# EAGLE schematic STorM32 NT imu module v008 mini (EAGLE 6.5.0)
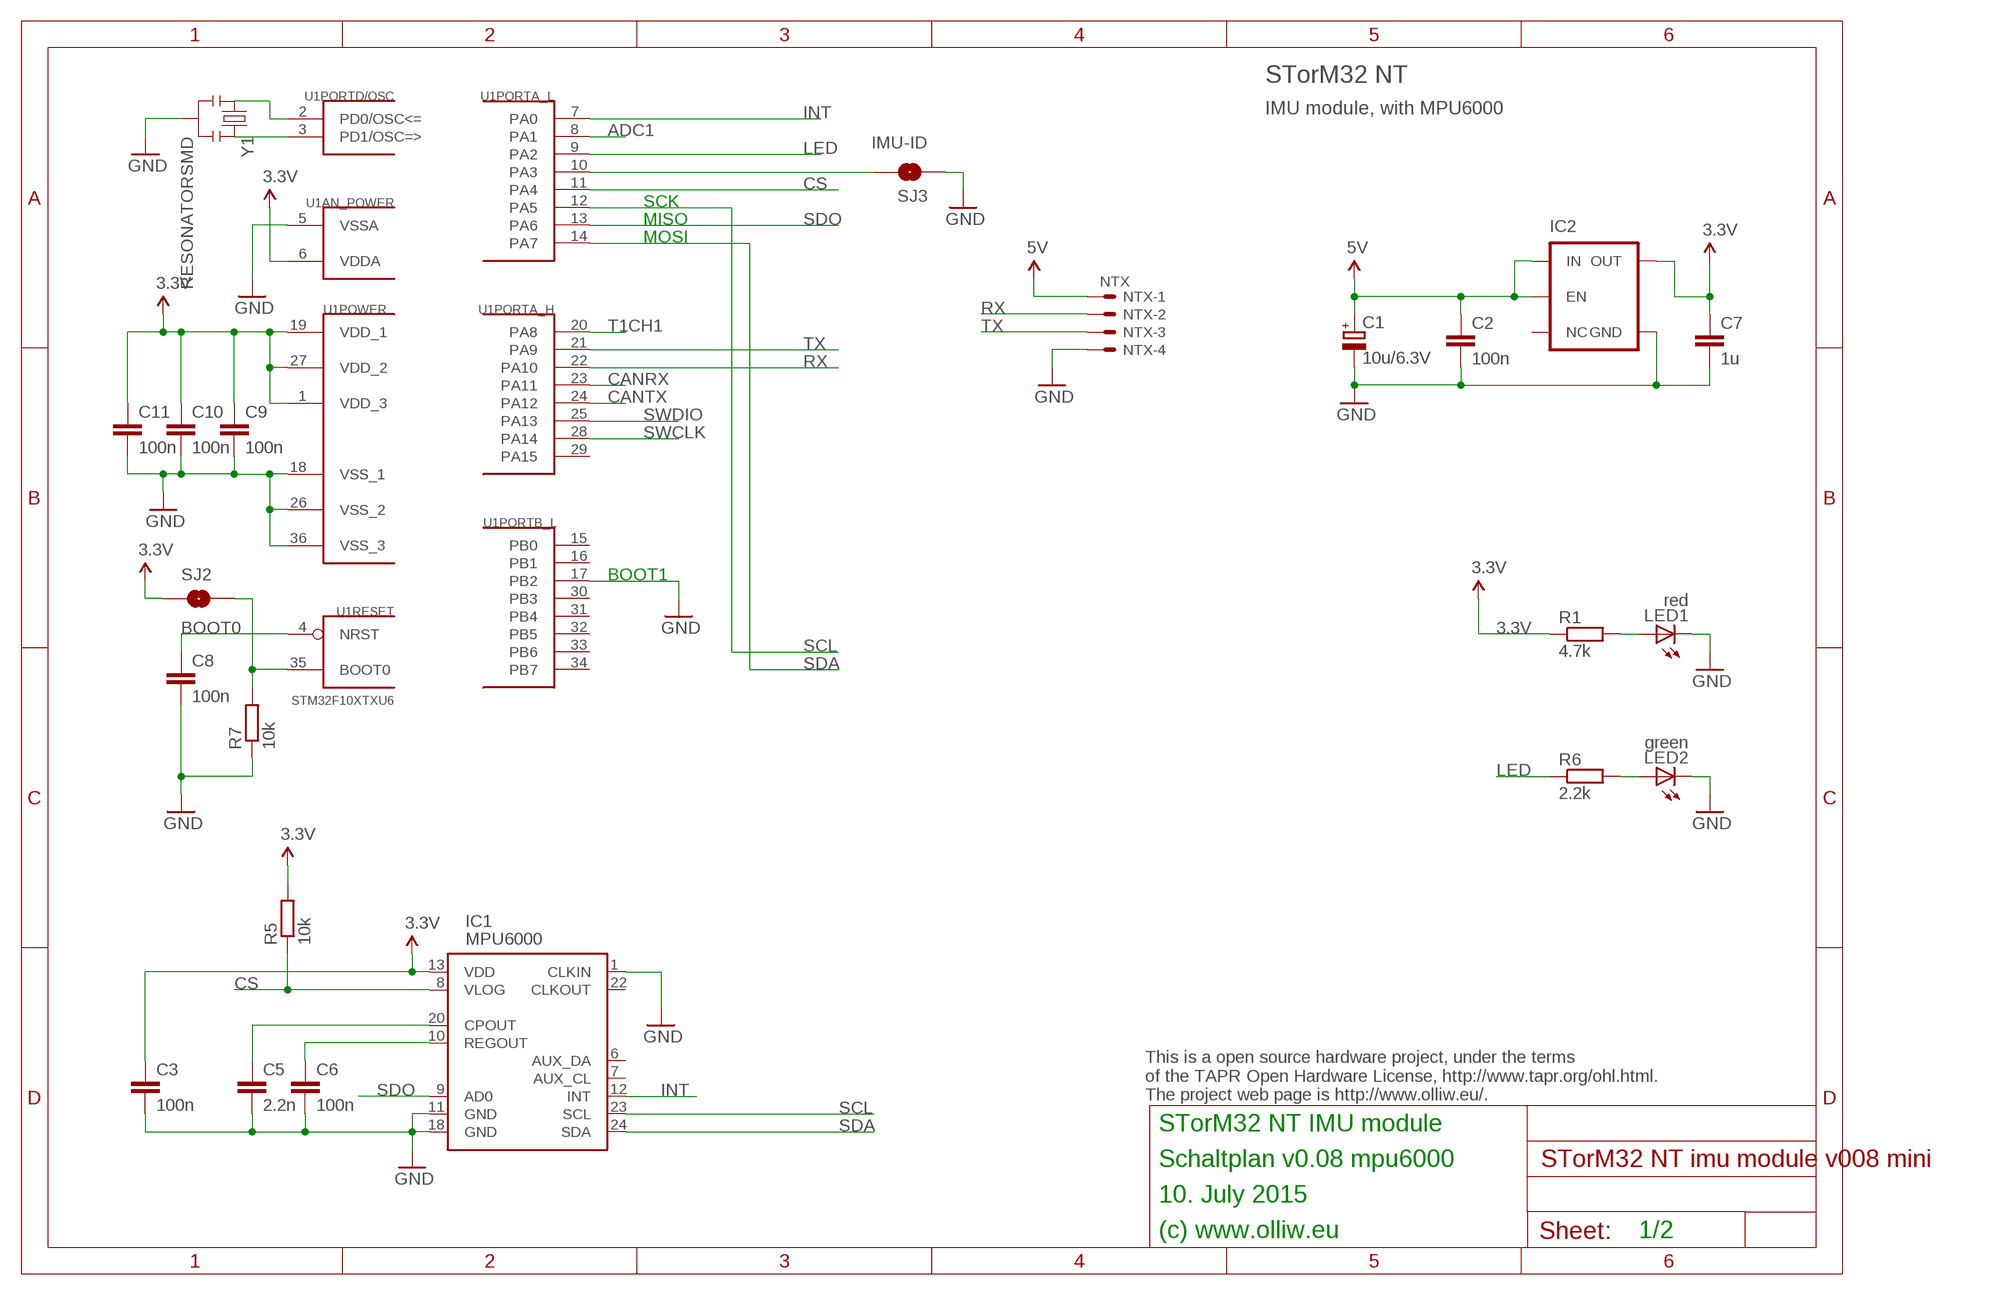
[diagram p0: schematic, sheet 1]

## Parts
C1  10u/6.3V  CPOL-EUSMCA  [SMC_A]
C2  100n  C-EUC0402  [C0402]
C3  100n  C-EUC0402  [C0402]
C5  2.2n  C-EUC0402  [C0402]
C6  100n  C-EUC0402  [C0402]
C7  1u  C-EUC0402  [C0402]
C8  100n  C-EUC0402  [C0402]
C9  100n  C-EUC0402  [C0402]
C10  100n  C-EUC0402  [C0402]
C11  100n  C-EUC0402  [C0402]
IC1  MPU6000  IMU3000  [QFN-24]
IC2  V_REG_TPS76433SOT23-5  [SOT23-5]
LED1  red  LEDCHIPLED_0603  [CHIPLED_0603]
LED2  green  LEDCHIPLED_0603  [CHIPLED_0603]
NTX  NTX  SM04B-SRSS-TB  [SM04B-SRSS-TB]
R1  4.7k  R-EU_R0402  [R0402]
R5  10k  R-EU_R0402  [R0402]
R6  2.2k  R-EU_R0402  [R0402]
R7  10k  R-EU_R0402  [R0402]
SJ2  BOOT0  SOLDERJUMPERNO  [SJ_2S-NO]
SJ3  IMU-ID  SOLDERJUMPERNO  [SJ_2S-NO]
U1  STM32F10XTXU6  [VFQFPN36]
Y1  RESONATORSMD  [RESONATOR-SMD]

## Nets
3.3V: C3.1 C7.1 C9.1 C10.1 C11.1 IC1.13(VDD) IC2.5(OUT) R1.1 R5.2 SJ2.1 U1.1(POWER:VDD_3) U1.6(AN_POWER:VDDA) U1.19(POWER:VDD_1) U1.27(POWER:VDD_2)
5V: C1.+ C2.1 IC2.1(IN) IC2.3(EN) NTX.1
ADC1: U1.8(PORTA_L:PA1)
CANRX: U1.23(PORTA_H:PA11)
CANTX: U1.24(PORTA_H:PA12)
CS: IC1.8(VLOG) R5.1 U1.11(PORTA_L:PA4)
GND: C1.- C2.2 C3.2 C5.2 C6.2 C7.2 C8.2 C9.2 C10.2 C11.2 IC1.1(CLKIN) IC1.11(GND) IC1.18(GND) IC2.2(GND) LED1.C LED2.C NTX.4 R7.1 SJ3.1 U1.5(AN_POWER:VSSA) U1.17(PORTB_L:PB2) U1.18(POWER:VSS_1) U1.26(POWER:VSS_2) U1.36(POWER:VSS_3) Y1.2
INT: IC1.12(INT) U1.7(PORTA_L:PA0)
LED: R6.1 U1.9(PORTA_L:PA2)
N$1: C8.1 U1.4(RESET:NRST)
N$2: LED2.A R6.2
N$3: R7.2 SJ2.2 U1.35(RESET:BOOT0)
N$5: U1.2(PORTD/OSC:PD0/OSC<=) Y1.1
N$6: U1.3(PORTD/OSC:PD1/OSC=>) Y1.3
N$9: LED1.A R1.2
N$20: C6.1 IC1.10(REGOUT)
N$24: C5.1 IC1.20(CPOUT)
RX: NTX.2 U1.22(PORTA_H:PA10)
RX2: SJ3.2 U1.10(PORTA_L:PA3)
SCL: IC1.23(SCL) U1.12(PORTA_L:PA5)
SDA: IC1.24(SDA) U1.14(PORTA_L:PA7)
SDO: IC1.9(AD0) U1.13(PORTA_L:PA6)
SWCLK: U1.28(PORTA_H:PA14)
SWDIO: U1.25(PORTA_H:PA13)
T1CH1: U1.20(PORTA_H:PA8)
TX: NTX.3 U1.21(PORTA_H:PA9)
Unconnected: IC1.6(AUX_DA) IC1.7(AUX_CL) IC1.22(CLKOUT) IC2.4(NC) U1.15(PORTB_L:PB0) U1.16(PORTB_L:PB1) U1.29(PORTA_H:PA15) U1.30(PORTB_L:PB3) U1.31(PORTB_L:PB4) U1.32(PORTB_L:PB5) U1.33(PORTB_L:PB6) U1.34(PORTB_L:PB7)

## Notes on the sheet
- STorM32 NT
- IMU module, with MPU6000
- SCK
- MISO
- MOSI
- BOOT1
- This is a open source hardware project, under the terms
  of the TAPR Open Hardware License, http://www.tapr.org/ohl.html.
  The project web page is http://www.olliw.eu/.
- STorM32 NT IMU module
- Schaltplan v0.08 mpu6000
- 10. July 2015
- (c) www.olliw.eu | 1/2

## Library data of the parts
C1 = rcl:CPOL-EU: POLARIZED CAPACITOR, European symbol
C2 C3 C5-C11 = rcl:C-EU: CAPACITOR, European symbol
IC1 = # SparkFun2:IMU3000
IC2 = # SparkFun2:V_REG_TPS76433: Voltage Regulator Older TI part. LDO 150mA regulator. No output by-pass cap option. See V_REG_LDO for a better part.
LED1 LED2 = led:LED: LED OSRAM: - CHIPLED LG R971, LG N971, LY N971, LG Q971, LY Q971, LO R971, LY R971 LH N974, LH R974 LS Q976, LO Q976, LY Q976 LO Q996 - Hyper CHIPLED LW Q18S LB Q993, LB Q99A, LB R99A - SideLED LS A670, LO A670, LY A670, LG A670, LP A670 LB A673, LV A673, LT A673, LW A673 LH A674 LY A675 LS A676, LA A676, LO A676, LY A676, LW A676 LS A679, LY A679, LG A679 - Hyper Micro SIDELED® LS Y876, LA Y876, LO Y876, LY Y876 LT Y87S - SmartLED LW L88C, LW L88S LB L89C, LB L89S, LG L890 LS L89K, LO L89K, LY L89K LS L896, LA L896, LO L896, LY L896 - TOPLED LS T670, LO T670, LY T670, LG T670, LP T670 LSG T670, LSP T670, LSY T670, LOP T670, LYG T670 LG T671, LOG T671, LSG T671 LB T673, LV T673, LT T673, LW T673 LH T674 LS T676, LA T676, LO T676, LY T676, LB T676, LH T676, LSB T676, LW T676 LB T67C, LV T67C, LT T67C, LS T67K, LO T67K, LY T67K, LW E67C LS E67B, LA E67B, LO E67B, LY E67B, LB E67C, LV E67C, LT E67C LW T67C LS T679, LY T679, LG T679 LS T770, LO T770, LY T770, LG T770, LP T770 LB T773, LV T773, LT T773, LW T773 LH T774 LS E675, LA E675, LY E675, LS T675 LS T776, LA T776, LO T776, LY T776, LB T776 LHGB T686 LT T68C, LB T68C - Hyper Mini TOPLED® LB M676 - Mini TOPLED Santana® LG M470 LS M47K, LO M47K, LY M47K Source: http://www.osram.convergy.de LUXEON: - LUMILED® LXK2-PW12-R00, LXK2-PW12-S00, LXK2-PW14-U00, LXK2-PW14-V00 LXK2-PM12-R00, LXK2-PM12-S00, LXK2-PM14-U00 LXK2-PE12-Q00, LXK2-PE12-R00, LXK2-PE12-S00, LXK2-PE14-T00, LXK2-PE14-U00 LXK2-PB12-K00, LXK2-PB12-L00, LXK2-PB12-M00, LXK2-PB14-N00, LXK2-PB14-P00, LXK2-PB14-Q00 LXK2-PR12-L00, LXK2-PR12-M00, LXK2-PR14-Q00, LXK2-PR14-R00 LXK2-PD12-Q00, LXK2-PD12-R00, LXK2-PD12-S00 LXK2-PH12-R00, LXK2-PH12-S00 LXK2-PL12-P00, LXK2-PL12-Q00, LXK2-PL12-R00 Source: www.luxeon.com KINGBRIGHT: KA-3528ASYC Source: www.kingbright.com
NTX = con-jst2:?M04B-SRSS-TB: Disconnectable Crimp style connector, 1.0mm pitch 4 contacts
R1 R5-R7 = rcl:R-EU_: RESISTOR, European symbol
SJ2 SJ3 = # SparkFun2:SOLDERJUMPER: Solder Jumper Standard SMD solder jumper. Used to automate production. Two varients : Normally Open and Normally Closed are the same, but have different paste layers. NC will have a large amount of paste and should jumper during reflow.
U1 = # stm32:STM32F10XTXU6: STM32F101/103 36pad VFQPFN36
Y1 = # SparkFun2:RESONATOR: Resonator Small SMD resonator. This is the itty bitty 10/20MHz resonators with built in caps. CSTCE10M0G55 and CSTCE20M0V53. Footprint has been reviewed closely but hasn't been tested yet.